# Altium schematic sheet SchematicV1.SchDoc
size A; SheetNumber: 1; SheetTotal: 1
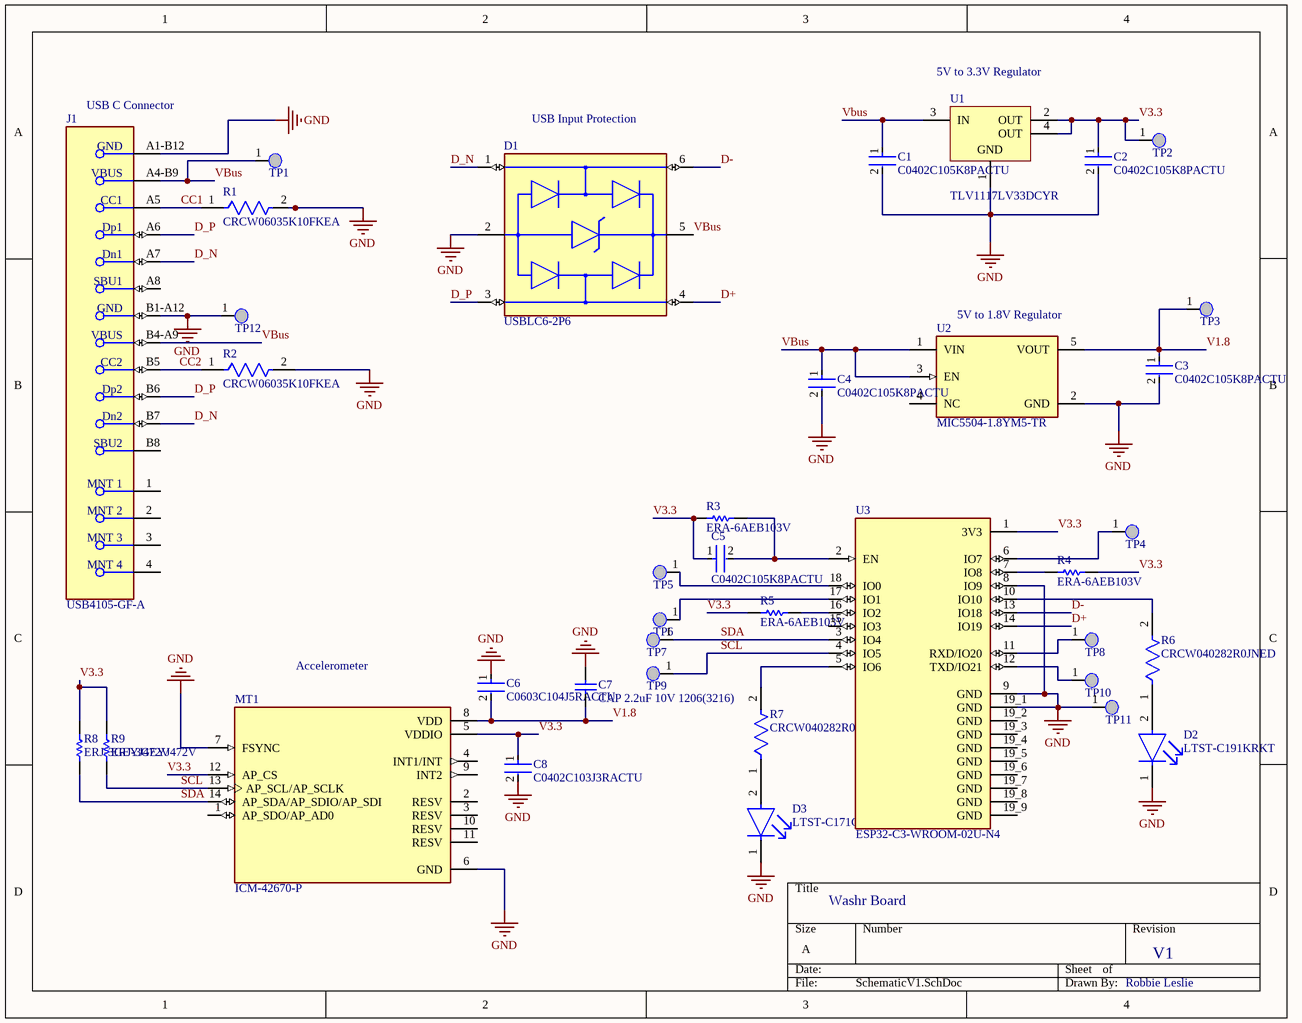
[diagram p0: SchematicV1.SchDoc]

## Parts
C1  C0402C105K8PACTU  [FP-C0402C105K8PACTU-MFG]
C2  C0402C105K8PACTU  [FP-C0402C105K8PACTU-MFG]
C3  C0402C105K8PACTU  [FP-C0402C105K8PACTU-MFG]
C4  C0402C105K8PACTU  [FP-C0402C105K8PACTU-MFG]
C5  C0402C105K8PACTU  [FP-C0402C105K8PACTU-MFG]
C6  C0603C104J5RACTU  [FP-C0603C-CF-MFG]
C7  CAP 2.2uF 10V 1206(3216)  [CAPC1206(3216)110_M]
C8  C0402C103J3RACTU  [FP-C0402-BB-MFG]
D1  USBLC6-2P6  [FP-SOT-666-MFG]
D2  LTST-C191KRKT  [FP-LTST-C191KRKT-MFG]
D3  LTST-C171GKT  [FP-LTST-C171GKT-MFG]
J1  USB4105-GF-A  [FP-USB4105-GF-A-MFG]
MT1  ICM-42670-P  [XDCR_ICM-42670-P]
R1  CRCW06035K10FKEA  [FP-CRCW0603-e3-IPC_C]
R2  CRCW06035K10FKEA  [FP-CRCW0603-e3-IPC_C]
R3  ERA-6AEB103V  [RESC2013X60X40LL20T25_A]
R4  ERA-6AEB103V  [RESC2013X60X40LL20T25_A]
R5  ERA-6AEB103V  [RESC2013X60X40LL20T25_A]
R6  CRCW040282R0JNED  [FP-CRCW0402-e3-IPC_A]
R7  CRCW040282R0JNED  [FP-CRCW0402-e3-IPC_A]
R8  ERJ-3GEYJ472V  [RESC1608X55X30LL15T15]
R9  ERJ-3GEYJ472V  [RESC1608X55X30LL15T15]
TP1  Testpin  [PCBComponent_1]  (value not drawn)  (no BOM)
TP2  Testpin  [PCBComponent_1]  (value not drawn)  (no BOM)
TP3  Testpin  [PCBComponent_1]  (value not drawn)  (no BOM)
TP4  Testpin  [PCBComponent_1]  (value not drawn)  (no BOM)
TP5  Testpin  [PCBComponent_1]  (value not drawn)  (no BOM)
TP6  Testpin  [PCBComponent_1]  (value not drawn)  (no BOM)
TP7  Testpin  [PCBComponent_1]  (value not drawn)  (no BOM)
TP8  Testpin  [PCBComponent_1]  (value not drawn)  (no BOM)
TP9  Testpin  [PCBComponent_1]  (value not drawn)  (no BOM)
TP10  Testpin  [PCBComponent_1]  (value not drawn)  (no BOM)
TP11  Testpin  [PCBComponent_1]  (value not drawn)  (no BOM)
TP12  Testpin  [PCBComponent_1]  (value not drawn)  (no BOM)
U1  TLV1117LV33DCYR  [DCY0004A_N]
U2  MIC5504-1.8YM5-TR  [FP-SOT23-5LD-PL-1-MFG]
U3  ESP32-C3-WROOM-02U-N4  [XCVR_ESP32-C3-WROOM-02U-N4]

## Nets
GND: C1.2 C2.2 C3.2 C4.2 C6.1 C7.1 C8.2 D1.2(GND) D2.1(C) D3.1(C) J1.A1-B12(GND) J1.B1-A12(GND) MT1.6(GND) MT1.7(FSYNC) R1.2 R2.2 TP11.1(TestPin) TP12.1(TestPin) U1.1(GND) U2.2(GND) U3.8(IO9) U3.9(GND) U3.19_1(GND)
CC1: J1.A5(CC1) R1.1
CC2: J1.B5(CC2) R2.1
D+: D1.4(I/O2) U3.14(IO19)
D-: D1.6(I/O1) U3.13(IO18)
D_N: D1.1(I/O1) J1.A7(Dn1) J1.B7(Dn2)
D_P: D1.3(I/O2) J1.A6(Dp1) J1.B6(Dp2)
SCL: MT1.13(AP_SCL/AP_SCLK) R9.1 TP9.1(TestPin) U3.4(IO5)
SDA: MT1.14(AP_SDA/AP_SDIO/AP_SDI) R8.1 TP7.1(TestPin) U3.3(IO4)
V1.8: C3.1 C6.2 C7.2 MT1.8(VDD) TP3.1(TestPin) U2.5(VOUT)
V3.3: C2.1 C5.1 C8.1 MT1.5(VDDIO) MT1.12(AP_CS) R3.1 R4.2 R5.2 R8.2 R9.2 TP2.1(TestPin) U1.2(OUT) U1.4(OUT) U3.1(3V3)
VBus: C1.1 C4.1 D1.5(VBUS) J1.A4-B9(VBUS) J1.B4-A9(VBUS) TP1.1(TestPin) U1.3(IN) U2.1(VIN) U2.3(EN)
NetC5_2: C5.2 R3.2 U3.2(EN)
NetD2_2: D2.2(A) R6.1
NetD3_2: D3.2(A) R7.1
NetR4_1: R4.1 U3.7(IO8)
NetR5_1: R5.1 U3.16(IO2)
NetR6_2: R6.2 U3.10(IO10)
NetR7_2: R7.2 U3.5(IO6)
NetTP4_1: TP4.1(TestPin) U3.6(IO7)
NetTP5_1: TP5.1(TestPin) U3.18(IO0)
NetTP6_1: TP6.1(TestPin) U3.17(IO1)
NetTP8_1: TP8.1(TestPin) U3.11(RXD/IO20)
NetTP10_1: TP10.1(TestPin) U3.12(TXD/IO21)

Not connected (* = marked no-connect by the designer): J1 1(MNT_1) 2(MNT_2) 3(MNT_3) 4(MNT_4) A8(SBU1) B8(SBU2); MT1 1(AP_SDO/AP_AD0) 2(RESV) 3(RESV) 4(INT1/INT) 9(INT2) 10(RESV) 11(RESV); U2 4(NC); U3 15(IO3) 19_2(GND) 19_3(GND) 19_4(GND) 19_5(GND) 19_6(GND) 19_7(GND) 19_8(GND) 19_9(GND)

## Notes on the sheet
- (near U1) 5V to 3.3V Regulator
- (near J1) USB C Connector
- (near D1) USB Input Protection
- (near U2) 5V to 1.8V Regulator
- (near MT1) Accelerometer
- Washr Board
- V1
- Robbie Leslie

## Library data of the parts
C1-C5 = CMP-2008-02081-2: CAP CER 1UF 10V X5R 0402; Dielectric Material: Ceramic; Dissipation Factor: 5%; Tolerance: 10%; Number of Pins: 2; Contact Plating: Tin; Min Operating Temperature: -55°C; Termination: SMD/SMT; Lead Free: Lead Free; Construction: Flat; Voltage Rating (DC): 10V; Mount: Surface Mount; Series: C; Thickness: 0.022inch; Width: 0.5mm; Radiation Hardening: No; Capacitance: 1uF; Dielectric: X5R; Height: 0.5mm; Voltage: 10V; Length: 1mm; Depth: 0.5mm; Max Operating Temperature: 85°C; Package Quantity: 1; Packaging: Tape and Reel; RoHS Compliant: Yes; Case Code (Imperial): 0402; Case Code (Metric): 1005; REACH SVHC: No SVHC; Voltage Rating: 10V; Case/Package: 0402
C6 = CMP-2006-03056-2: CAP CER 0.1UF 50V 5% X7R 0603; Manufacturer: KEMET; Automotive Grade: Grade 1; Tolerance: 0.05; Capacitance: 0.10 μF; Value: 0.10 μF; Material: Ceramic; Temperature Coefficient: 30ppm/°C; ComponentLink2Description: Datasheet; Voltage Rating: 50 V; Digikey Description: CAP CER 0.1UF 50V 5% X7R 0603; Manufacturer Part Number: C0603C104J5RACTU; Temperature Range High: +125°C; Device Class L2: Capacitors; Octopart: https://octopart.com/c0603c104j5ractu-kemet-10440638; RoHS: TRUE; Mouser Description: Multilayer Ceramic Capacitors MLCC - SMD/SMT 50volts 0.1uF X7R 5%; Temperature Range Low: -55°C; Automotive: Yes; Lead Free: Yes; ComponentLink2URL: https://api.kemet.com/component-edge/download/datasheet/C0603C100J5GACAUTO.pdf; Device Class L3: Ceramic Capacitors; Package: C0603C-CF; Category: Cap; Temperature: -55°C to +125°C; Height: 0.87mm; Temperature Characteristic: X7R; Device Class L1: Passive Components
C7 = CMP-1037-04796-1: CAP 2.2uF 10V ±10% 1206 (3216 Metric) Thickness 1.1mm SMD; Case-EIA: 1206; Tolerance: Â±10%; Case-Metric: 3216; Technology: SMT; Max Thickness: 1.1 mm; Rated Voltage: 10 V; Value: 2.2uF
C8 = CMP-2008-03065-2: CAP CER 10000PF 25V X7R 0402; Manufacturer: Kemet; Capacitance: 10,000 pF; Tolerance: 0.05; Value: 10,000 pF; Temperature Coefficient: 15%; Material: Ceramic; Device Class L1: Passive Components; Automotive: No; Lead Free: Yes; Package: C0402-BB; Temperature: -55°C to +125°C; Height: 0.55mm; Manufacturer Part Number: C0402C103J3RACTU; Temperature Range Low: -55°C; ComponentLink2URL: https://content.kemet.com/datasheets/KEM_C1002_X7R_SMD.pdf; Temperature Range High: +125°C; RoHS: TRUE; Device Class L2: Capacitors; ComponentLink2Description: Datasheet; Octopart: https://octopart.com/c0402c103j3ractu-kemet-135051; Temperature Characteristic: X7R; Ipc Land Pattern Name: CAPC10050X50; Digikey Description: CAP CER 10000PF 25V X7R 0402; Category: Cap; Device Class L3: Ceramic Capacitors; Mouser Description: Multilayer Ceramic Capacitors MLCC - SMD/SMT 25volts 10000pF X7R 5%; Voltage Rating: 25 V
D1 = CMP-12225-000058-1: TVS DIODE 5.25V 17V SOT666; Min Breakdown Voltage: 6V; Power Line Protection: Yes; Element Configuration: Dual; Test Current: 1mA; Working Voltage: 5V; Number of Channels: 2; Max Reverse Leakage Current: 150nA; Direction: Unidirectional; Peak Pulse Current: 5A; Number of Elements: 1; Capacitance: 3.5pF; Max Breakdown Voltage: 6V; Height: 0.6mm; Depth: 1.3mm; Contact Plating: Tin; Reverse Breakdown Voltage: 6V; REACH SVHC: No SVHC; Operating Supply Voltage: 5V; Width: 1.3mm; Max Operating Temperature: 125°C; Reverse Standoff Voltage: 5V; ESD Protection: Yes; Package Quantity: 1; Termination: SMD/SMT; Length: 1.7mm; Leakage Current: 150nA; Number of Bidirectional Channels: 2; Case/Package: SOT-666; Min Operating Temperature: -40°C; Number of Pins: 6; Clamping Voltage: 17V; Breakdown Voltage: 6V; Lead Free: Lead Free; Radiation Hardening: No; Packaging: Tape and Reel; Mount: Surface Mount; Polarity: Unidirectional
D2 = CMP-2000-05199-2: NexarPartId: 549908; Illumination Color: Red; Lens Transparency: Clear; Luminous Intensity: 54mcd; Current: 2A; Forward Current: 20mA; Number of Elements: 1; Power Rating: 75mW; Lens Color: Colorless; Wavelength: 639nm; Viewing Angle: 130°; Voltage: 2V; Dominant Wavelength: 631nm; Reverse Voltage: 5V; Height: 550µm; Length: 1.6mm; Number of Pins: 2; Packaging: Tape and Reel; Mount: Surface Mount; Case Code (Metric): 1608; Radiation Hardening: No; Case Code (Imperial): 0603; Test Current: 20mA; Number of LEDs: 1; Schedule B: 8541402000, 8541402000; Lead Free: Lead Free; Power Dissipation: 75mW; RoHS: Compliant; Forward Voltage: 2V; Lens Style: Clear; Color: Red; Max Operating Temperature: 85°C; Depth: 800µm; Width: 800µm; Min Operating Temperature: -55°C; Case/Package: 0603
D3 = CMP-22017-000007-1: LED GREEN CLEAR CHIP SMD; Luminous Intensity: 12mcd; Lens Color: Colorless; Dominant Wavelength: 569nm; Number of LEDs: 1; Power Dissipation: 100mW; Viewing Angle: 130°; Reverse Voltage: 5V; Test Current: 10mA; Forward Voltage: 2.1V; Wavelength: 585nm; Lens Style: Diffused; Forward Current: 30mA; Height: 0.8mm; Mount: Surface Mount; Package Quantity: 1; Length: 2mm; Case Code (Metric): 2012; Number of Pins: 2; Number of Elements: 1; Packaging: Tape and Reel; Color: Green; Min Operating Temperature: -55°C; Case/Package: 0805; Power Rating: 100mW; Max Operating Temperature: 85°C; Radiation Hardening: No; Depth: 1.25mm; Lens Transparency: Clear; Width: 1.25mm; Lead Free: Lead Free; Case Code (Imperial): 0805; Illumination Color: Green
J1 = CMP-245163-000001-1: CONN RCPT USB2.0 TYPEC 5A; Manufacturer: GCT; Voltage Rating: 20V; Is Female: yes; Current Rating: 5/6.25/1.25/0.25A; Number Of Contacts: 16; Conn Orientation: Right Angle; Device Class L1: Connectors; Category: Conn; Lead Free: Yes; RoHS: TRUE; Temperature Range High: +85°C; Digikey Description: CONN RCPT USB2.0 TYPEC 5A; Device Class L3: unset; ComponentLink2Description: Datasheet; Manufacturer Part Number: USB4105-GF-A; Package: 0; Usb Standard: USB 2.0; Device Class L2: USB Connectors; Automotive: No; Temperature Range Low: -40°C; Height: 3.46mm; Temperature: -40°C to +85°C; Contact Material: Gold,Nickel; ComponentLink2URL: https://gct.co/files/drawings/usb4105.pdf; Octopart: https://octopart.com/usb4105-gf-a-gct-106627878
R1 R2 = CMP-1012-00590-3: RES Thick Film, 5.1kΩ, 1%, 0.1W, 100ppm/°C, 0603; Power Rating: 100mW; Voltage Rating (DC): 75V; Resistance: 5.1kR; Width: 0.85mm; Depth: 0.85mm; Military Standard: Not; Package Quantity: 5000; Case Code (Metric): 1608; Length: 1.55mm; Weight: 7.1E-05oz; Packaging: Tape and Reel; Temperature Coefficient: 100ppm/°C; Case Code (Imperial): 0603; Lead Free: Lead Free; Radiation Hardening: No; Contact Plating: Tin; Composition: Thick Film; Max Operating Temperature: 155°C; Termination: SMD/SMT; Case/Package: 0603; Min Operating Temperature: -55°C; Tolerance: 1%; Voltage Rating: 75V; Mount: Surface Mount; Height: 0.45mm
R3-R5 = CMP-2001-00582-2: Metal Film Chip Resistor, High Reliability Type, 0.125 W, +/- 0.1%, -55 to 155 degC, 0805 (2012 Metric), RoHS, Tape and Reel; Voltage Rating: 100V; Power Rating: 125mW(1/8W); Brand: Panasonic; Temperature Coefficient: 25PPM/C; Resistance: 10kOhms; Product Category: ThinFilmResistors-SMD; Datasheet Version: 02/2016; Operating Temperature Range: -55Cto+155C; Length: 2mm; Mounting Technology: SurfaceMount; Manufacturer URL: http://www.panasonic.com/; Width: 1.25mm; Packaging: Reel; Product: ThinFilmResistorsSMD; Package / Case: 0805(2012metric); Termination Style: SMD/SMT; Tolerance: 0.1%; Datasheet URL: https://industrial.panasonic.com/cdbs/www-data/pdf/RDM0000/AOA0000C307.pdf; Package Description: 2-Pin Surface Mount Device, Body 2 x 1.25 mm; Factory Pack Quantity: 5000; Series: ERA-6A; Case Code - mm: 2012; RoHS: Details; Package Reference: 0805; Height: 0.5mm; Manufacturer: Panasonic; Case Code - in: 0805; Type: MetalFilmChipResistors
R6 R7 = CMP-2002-00239-2: RES Thick Film, 82Ω, 5%, 0.063W, 200ppm/°C, 0402; Voltage Rating (DC): 50V; Power Rating: 63mW; Resistance: 82R; Weight: 2.3E-05oz; Lead Free: Lead Free; Width: 0.5mm; Contact Plating: Tin; Temperature Coefficient: 200ppm/°C; Tolerance: 5%; Number of Terminations: 2; Military Standard: Not; Package Quantity: 1; Case Code (Metric): 1005; Max Operating Temperature: 155°C; Packaging: Tape and Reel; Composition: Thick Film; Case/Package: 0402; Radiation Hardening: No; Number of Pins: 2; Termination: SMD/SMT; Height: 0.016inch; Depth: 0.5mm; Min Operating Temperature: -55°C; Length: 1mm; Features: Automotive AEC-Q200; Case Code (Imperial): 0402; Voltage Rating: 50V; Max Power Dissipation: 63mW
R8 R9 = CMP-2000-00796-1: Manufacturer: Panasonic; Part Number: ERJ-3GEYJ472V
TP1-TP12 = Testpin1
U1 = CMP-0395-00503-2: Single Output LDO, 1 A, Fixed 3.3 V Output, 2 to 5.5 V Input, 4-pin SOT-223 (DCY), -40 to 125 degC, Green (RoHS & no Sb/Br); Manufacturer: Texas Instruments; Vout Adj(Min)(V): 3.3; Vdo(Typ)(mV): 1200; Iq(Typ)(mA): 0.05; Accuracy(%): 2; Iout(Max)(A): 1; SubFamily: Single Channel LDO; Vin(Max)(V): 5.5; PackageReference: DCY0004A; PackageDescription: 4-Pin Plastic Small Outline, Body 3.5 x 6.5 mm, Pitch 2.3 mm; Vout Adj(Max)(V): 3.3; Mounting Technology: Surface Mount; ComponentLink2Description: Datasheet; ComponentLink1Description: Manufacturer URL; PartNumber: TLV1117LV33DCYR; ComponentLink3Description: Package Specification; ComponentLink1URL: http://www.ti.com/; ComponentLink2URL: http://www.ti.com/general/docs/lit/getliterature.tsp?genericPartNumber=TLV1117LV33&fileType=pdf; Fixed Output Options(V): 3.3; PackageVersion: 4202506/B; Vin(Min)(V): 2; DatasheetVersion: SBVS160A; Eco-Plan: Green (RoHS & no Sb/Br); ComponentLink3URL: http://www.ti.com/litv/pdf/mpds094a; Code_JEDEC: TO-261
U2 = CMP-06324-000021-1: IC REG LINEAR 1.8V 300MA SOT23-5; Manufacturer: Microchip; Dropout Voltage: 160mV; Number Of Outputs: 1; Nominal Supply Current: 38-42uA; Accuracy Percentage: 2%; Max Supply Voltage: 5.5V; Max Junction Temp: +125°C; Min Supply Voltage: 2.5V; Standoff Height: 0mm; Output Type: Fixed; Temperature Range Low: -40°C; Temperature Range High: +125°C; Automotive: No; Octopart: https://octopart.com/mic5504-1.8ym5-tr-microchip-66803399; RoHS: TRUE; Device Class L1: Integrated Circuits (ICs); Device Class L3: Voltage Regulators - Linear; Package: SOT23-5LD-PL-1; Device Class L2: Power Management ICs; Output Current: 300mA; Digikey Description: IC REG LINEAR 1.8V 300MA SOT23-5; Lead Free: Yes; Output Voltage: 1.8V; Height: 1.45mm; Category: IC; ComponentLink2Description: Datasheet; Temperature: -40°C to +125°C; ComponentLink2URL: http://ww1.microchip.com/downloads/en/DeviceDoc/MIC5501-02-03-04-300mA-Single-Output-LDO-in-Small-Packages-DS20006006B.pdf; Manufacturer Part Number: MIC5504-1.8YM5-TR
U3 = ESP32-C3-WROOM-02U-N4: Bluetooth, WiFi 802.11b/g/n, Bluetooth v5.0 Transceiver Module 2.4GHz Antenna Not Included, U.FL Surface Mount; MF: Espressif Systems; SnapEDA_Link: https://www.snapeda.com/parts/ESP32-C3-WROOM-02U-N4/Espressif+Systems/view-part/?ref=snap; Package: SMD-19 Espressif Systems; Value: *; MP: ESP32-C3-WROOM-02U-N4; Check_prices: https://www.snapeda.com/parts/ESP32-C3-WROOM-02U-N4/Espressif+Systems/view-part/?ref=eda
MT1 = ICM-42670-P: Package: None; Price: None; Value: *; MP: ICM-42670-P; Availability: Unavailable; Supplier 1: Mouser; Supplier Part Number 1: 410-ICM-42670-P